# Altium project Atlas_Sensor_Board_RevA.PrjPcb
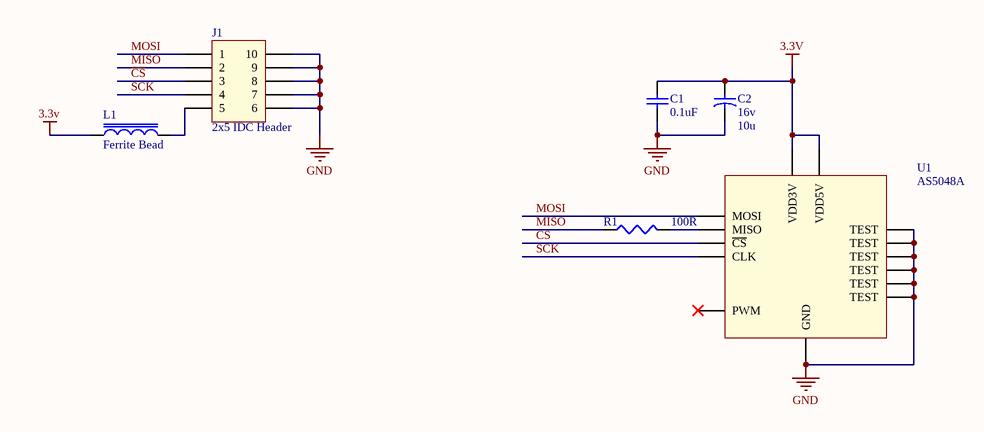
[diagram p0: Atlas_Sensor_Board_RevA.SchDoc]
1 sheet, 6 parts. Net scope: global (net labels, ports and power ports of the same name join across sheets).
Board file: Atlas_Sensor_Board_RevA.pcbdoc

## Sheet Atlas_Sensor_Board_RevA.SchDoc
size A

### Parts
C1  0.1uF  [CAP0603W]
C2  Voltage: 16v  [SMD Elec Cap (5.8_5.8_4)]  (hidden comment: 10u)
J1  87831-1010  [MOLEX_87831-1010]  (value not drawn)
L1  Ferrite Bead  [RES0603W]
R1  100R  [RES0603W]
U1  AS5048A  [TSSOP14]

### Nets
3.3V: C1.1 C2.2 L1.1 U1.11(VDD5V) U1.12(VDD3V)
GND: C1.2 C2.1 J1.6 J1.7 J1.8 J1.9 J1.10 U1.5(TEST) U1.6(TEST) U1.7(TEST) U1.8(TEST) U1.9(TEST) U1.10(TEST) U1.13(GND)
~{CS}: J1.3 U1.1(~{CS})
MISO: J1.2 R1.1
MOSI: J1.1 U1.4(MOSI)
SCK: J1.4 U1.2(CLK)
NetJ1_5: J1.5 L1.2
NetR1_2: R1.2 U1.3(MISO)

Not connected (* = marked no-connect by the designer): U1 14(PWM)*

### Library data of the parts
C1 = 0.1uF: MFG1_PN: VJ0603Y104JXJPW1BC; MFG1: Vishay; Value: 0.1uF
C2 = 10uF 16v: Tolerance: 20%; MFG_PN: EEE-FK1C100R; MFG: Panasonic; LOAD: NL; Value: 10u
J1 = 2x5 IDC/Ribbon Header: 2x5 IDC Header; MFG: MOLEX; ROWS: 2; POSITIONS: 10; CURRENT: 2A; MATES_WITH: 87568-1063; MFG_PN: 87831-1010; TYPE: 2x5 IDC Header
L1 = Ferrite Bead: EMI Suppression/Ferrite Bead; MFG: VISHAY; MFG_PN: ILBB0603ER400V; Value: 40R; CURRENT: 400mA
R1 = 100R (0603): Tolerance: 1%; POWER: 0.1W; MFG_PN: CRCW0603100RFKEA; MFG: Vishay; Load: NL; Value: 100R
U1 = AS5048A: 14bit Rotational Hall Effect Sensor; MFG: AMS; MFG_PN: AS5048A-HTSP-500